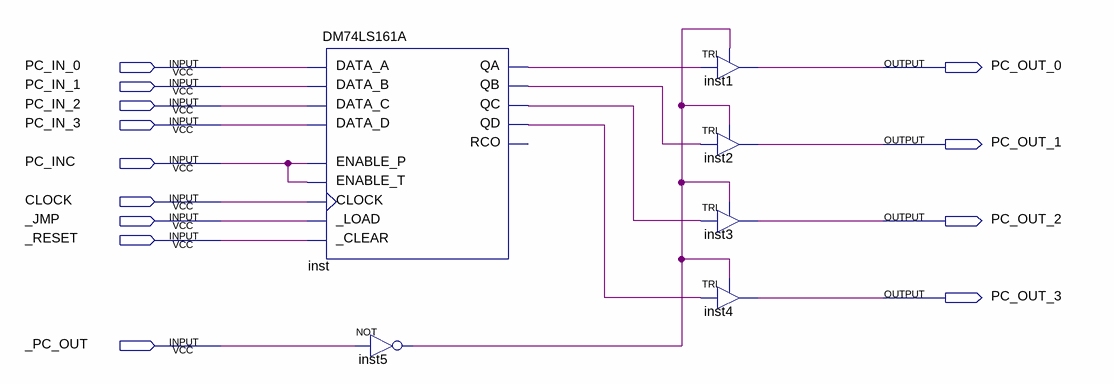
[diagram p0: schematic sheet]
// Quartus schematic PC.bdf as structural Verilog: 6 symbols, 13 pins
module PC (
  input  PC_IN_0,
  input  PC_IN_1,
  input  PC_IN_2,
  input  PC_IN_3,
  input  PC_INC,
  input  CLOCK,
  input  _JMP,
  input  _RESET,
  input  _PC_OUT,
  output PC_OUT_0,
  output PC_OUT_1,
  output PC_OUT_2,
  output PC_OUT_3
);

  wire inst5_out, inst_qa, inst_qb, inst_qc, inst_qd;

  DM74LS161A inst (
    .CLOCK(CLOCK), .DATA_A(PC_IN_0), .DATA_B(PC_IN_1), .ENABLE_P(PC_INC), .ENABLE_T(PC_INC),
    .DATA_C(PC_IN_2), .DATA_D(PC_IN_3), ._LOAD(_JMP), ._CLEAR(_RESET), .QA(inst_qa), .QB(inst_qb),
    .QC(inst_qc), .QD(inst_qd));  // open: RCO
  not inst5 (inst5_out, _PC_OUT);
  TRI inst1 (.IN(inst_qa), .OE(inst5_out), .OUT(PC_OUT_0));
  TRI inst2 (.IN(inst_qb), .OE(inst5_out), .OUT(PC_OUT_1));
  TRI inst3 (.IN(inst_qc), .OE(inst5_out), .OUT(PC_OUT_2));
  TRI inst4 (.IN(inst_qd), .OE(inst5_out), .OUT(PC_OUT_3));
endmodule
